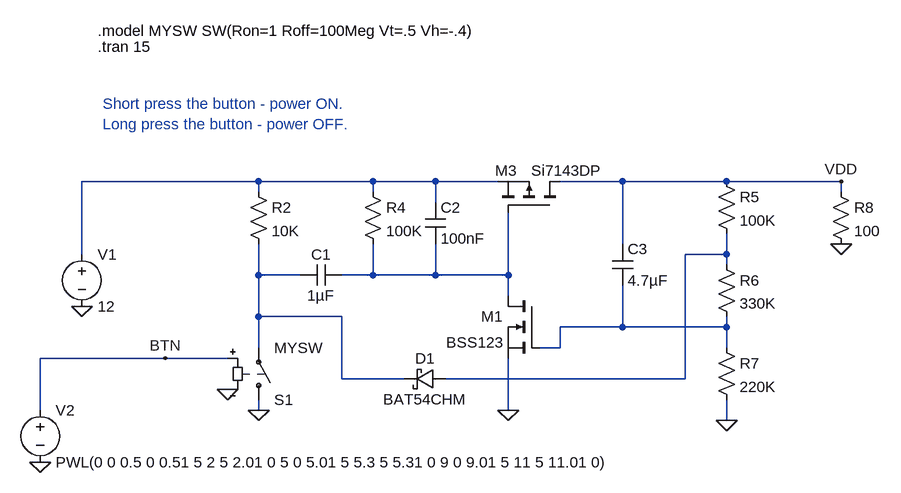
[diagram p0: schematic power_on_off.asc]
power_on_off.asc, the LTspice schematic file:
Version 4
SHEET 1 1012 680
WIRE -240 -416 -512 -416
WIRE -64 -416 -240 -416
WIRE 32 -416 -64 -416
WIRE 128 -416 32 -416
WIRE 320 -416 224 -416
WIRE 480 -416 320 -416
WIRE 656 -416 480 -416
WIRE -240 -400 -240 -416
WIRE -64 -400 -64 -416
WIRE 656 -400 656 -416
WIRE 32 -384 32 -416
WIRE 320 -320 320 -416
WIRE -512 -304 -512 -416
WIRE 480 -304 480 -336
WIRE 480 -304 416 -304
WIRE 480 -288 480 -304
WIRE -240 -272 -240 -320
WIRE -176 -272 -240 -272
WIRE -64 -272 -64 -320
WIRE -64 -272 -112 -272
WIRE 32 -272 32 -320
WIRE 32 -272 -64 -272
WIRE 144 -272 144 -368
WIRE 144 -272 32 -272
WIRE 144 -240 144 -272
WIRE -240 -208 -240 -272
WIRE -112 -208 -240 -208
WIRE 320 -192 320 -256
WIRE 320 -192 224 -192
WIRE 480 -192 480 -208
WIRE 480 -192 320 -192
WIRE -240 -160 -240 -208
WIRE 224 -160 224 -192
WIRE 224 -160 192 -160
WIRE 480 -160 480 -192
WIRE -384 -144 -576 -144
WIRE -288 -144 -384 -144
WIRE -112 -112 -112 -208
WIRE -16 -112 -112 -112
WIRE 416 -112 416 -304
WIRE 416 -112 48 -112
WIRE -576 -64 -576 -144
WIRE -240 -64 -240 -80
WIRE 144 -64 144 -144
WIRE 480 -48 480 -80
FLAG 480 -48 0
FLAG 144 -64 0
FLAG -240 -64 0
FLAG -512 -224 0
FLAG -288 -96 0
FLAG -576 16 0
FLAG 656 -320 0
FLAG 656 -416 VDD
FLAG -384 -144 BTN
SYMBOL pmos 224 -368 M270
WINDOW 0 65 66 VRight 2
WINDOW 3 65 45 VLeft 2
SYMATTR InstName M3
SYMATTR Value Si7143DP
SYMBOL sw -240 -64 M180
SYMATTR InstName S1
SYMATTR Value MYSW
SYMBOL res -256 -416 R0
SYMATTR InstName R2
SYMATTR Value 10K
SYMBOL cap -112 -288 R90
WINDOW 0 0 32 VBottom 2
WINDOW 3 32 32 VTop 2
SYMATTR InstName C1
SYMATTR Value 1µF
SYMBOL res -80 -416 R0
SYMATTR InstName R4
SYMATTR Value 100K
SYMBOL cap 16 -320 M180
WINDOW 0 24 56 Left 2
WINDOW 3 24 8 Left 2
SYMATTR InstName C2
SYMATTR Value 100nF
SYMBOL cap 304 -256 M180
WINDOW 0 24 56 Left 2
WINDOW 3 24 8 Left 2
SYMATTR InstName C3
SYMATTR Value 4.7µF
SYMBOL res 464 -432 R0
SYMATTR InstName R5
SYMATTR Value 100K
SYMBOL res 464 -304 R0
SYMATTR InstName R6
SYMATTR Value 330K
SYMBOL res 464 -176 R0
SYMATTR InstName R7
SYMATTR Value 220K
SYMBOL voltage -512 -320 R0
WINDOW 123 0 0 Left 0
WINDOW 39 0 0 Left 0
SYMATTR InstName V1
SYMATTR Value 12
SYMBOL voltage -576 -80 R0
WINDOW 123 0 0 Left 0
WINDOW 39 0 0 Left 0
SYMATTR InstName V2
SYMATTR Value PWL(0 0 0.5 0 0.51 5 2 5 2.01 0 5 0 5.01 5 5.3 5 5.31 0 9 0 9.01 5 11 5 11.01 0)
SYMBOL res 640 -416 R0
SYMATTR InstName R8
SYMATTR Value 100
SYMBOL nmos 192 -240 M0
SYMATTR InstName M1
SYMATTR Value BSS123
SYMBOL schottky 48 -128 R90
WINDOW 0 0 32 VBottom 2
WINDOW 3 32 32 VTop 2
SYMATTR InstName D1
SYMATTR Value BAT54CHM
SYMATTR Description Diode
SYMATTR Type diode
TEXT -488 -624 Left 2 !.tran 15
TEXT -480 -536 Left 2 ;Short press the button - power ON. \nLong press the button - power OFF.
TEXT -488 -648 Left 2 !.model MYSW SW(Ron=1 Roff=100Meg Vt=.5 Vh=-.4)

The netlist it stands for:
* power_on_off.asc
M3 VDD N004 N001 N001 Si7143DP
S1 0 N003 BTN 0 MYSW
R2 N001 N003 10K
C1 N004 N003 1µF
R4 N001 N004 100K
C2 N004 N001 100nF
C3 N005 VDD 4.7µF
R5 VDD N002 100K
R6 N002 N005 330K
R7 N005 0 220K
V1 N001 0 12
V2 BTN 0 PWL(0 0 0.5 0 0.51 5 2 5 2.01 0 5 0 5.01 5 5.3 5 5.31 0 9 0 9.01 5 11 5 11.01 0)
R8 VDD 0 100
M1 N004 N005 0 0 BSS123
D1 N002 N003 BAT54CHM
.model D D
.lib standard.dio
.model NMOS NMOS
.model PMOS PMOS
.lib standard.mos
.tran 15
* Short press the button - power ON.
* Long press the button - power OFF.
.model MYSW SW(Ron=1 Roff=100Meg Vt=.5 Vh=-.4)
.backanno
.end